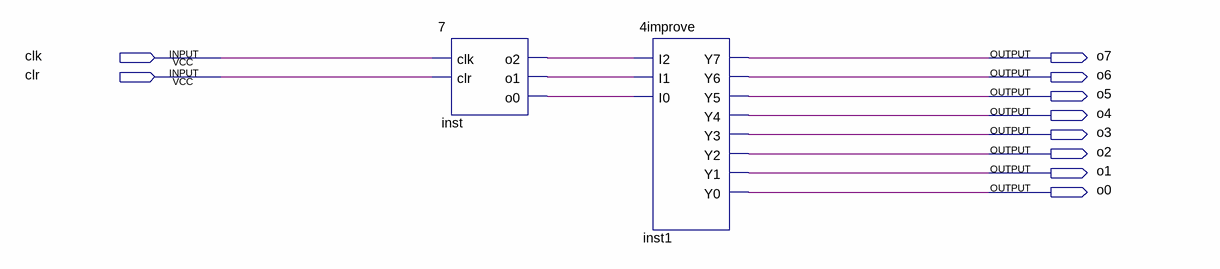
[diagram p0: schematic sheet]
// Quartus schematic 8.bdf as structural Verilog: 2 symbols, 10 pins
module \8  (
  input  clk,
  input  clr,
  output o7,
  output o6,
  output o5,
  output o4,
  output o3,
  output o2,
  output o1,
  output o0
);

  wire inst_o0, inst_o1, inst_o2;

  \7  inst (.clk(clk), .clr(clr), .o2(inst_o2), .o1(inst_o1), .o0(inst_o0));
  \4improve  inst1 (
    .I2(inst_o2), .I1(inst_o1), .I0(inst_o0), .Y7(o7), .Y6(o6), .Y5(o5), .Y4(o4), .Y3(o3), .Y2(o2), .Y1(o1),
    .Y0(o0));
endmodule
